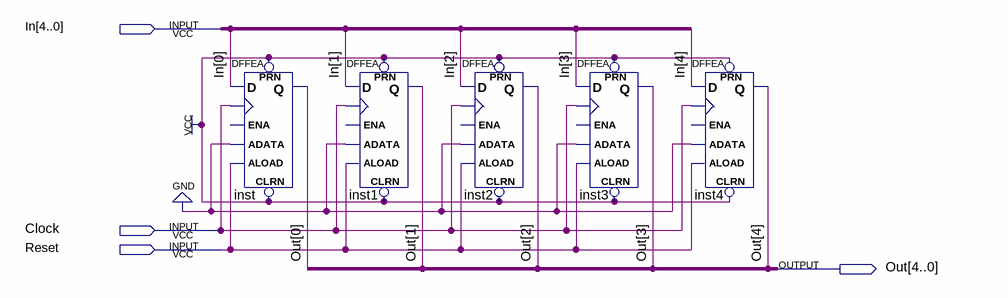
[diagram p0: schematic sheet]
// Quartus schematic Register.bdf as structural Verilog: 5 symbols, 4 pins
module Register (
  input  [4:0] In,
  input  Clock,
  input  Reset,
  output [4:0] Out
);

  DFFEA inst (.PRN(1'b1), .ALOAD(Reset), .ADATA(1'b0), .CLK(Clock), .D(In[0]), .CLRN(1'b1), .Q(Out[0]));  // open: ENA
  DFFEA inst1 (.PRN(1'b1), .ALOAD(Reset), .ADATA(1'b0), .CLK(Clock), .D(In[1]), .CLRN(1'b1), .Q(Out[1]));  // open: ENA
  DFFEA inst2 (.PRN(1'b1), .ALOAD(Reset), .ADATA(1'b0), .CLK(Clock), .D(In[2]), .CLRN(1'b1), .Q(Out[2]));  // open: ENA
  DFFEA inst3 (.PRN(1'b1), .ALOAD(Reset), .ADATA(1'b0), .CLK(Clock), .D(In[3]), .CLRN(1'b1), .Q(Out[3]));  // open: ENA
  DFFEA inst4 (.PRN(1'b1), .ALOAD(Reset), .ADATA(1'b0), .CLK(Clock), .D(In[4]), .CLRN(1'b1), .Q(Out[4]));  // open: ENA
endmodule
